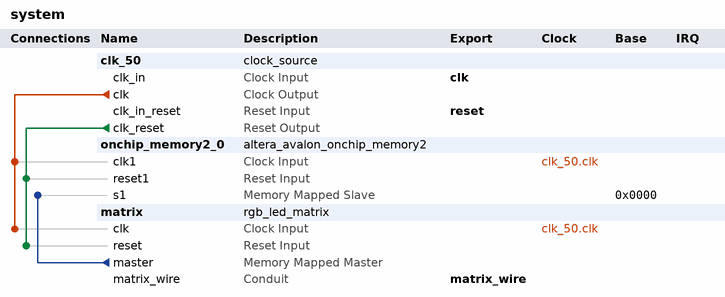
[diagram p0: system contents]
# Platform Designer (Qsys) system system, Cyclone IV E EP4CE22F17C6
# Parameters at their usual value, and those the tool derives, are not listed.
package require -exact qsys 17.1
create_system system
set_project_property DEVICE_FAMILY {Cyclone IV E}
set_project_property DEVICE EP4CE22F17C6

add_instance clk_50 clock_source 17.1
set_instance_parameter_value clk_50 clockFrequency 50000000

add_instance onchip_memory2_0 altera_avalon_onchip_memory2 17.1
set_instance_parameter_value onchip_memory2_0 dataWidth 64
set_instance_parameter_value onchip_memory2_0 dualPort false
set_instance_parameter_value onchip_memory2_0 initMemContent true
set_instance_parameter_value onchip_memory2_0 initializationFileName mif/test.mif
set_instance_parameter_value onchip_memory2_0 memorySize 16384
set_instance_parameter_value onchip_memory2_0 useNonDefaultInitFile true

add_instance matrix rgb_led_matrix 1.0
set_instance_parameter_value matrix INPUT_CLK_FRQ 50000000
set_instance_parameter_value matrix MATRIX_HEIGHT 32
set_instance_parameter_value matrix MATRIX_WIDTH 64
set_instance_parameter_value matrix NUM_OF_MATRICES 2
set_instance_parameter_value matrix RAM_ADDRESS_WIDTH 14

# connections
add_connection clk_50.clk matrix.clk clock
add_connection clk_50.clk onchip_memory2_0.clk1 clock
add_connection clk_50.clk_reset matrix.reset reset
add_connection clk_50.clk_reset onchip_memory2_0.reset1 reset
add_connection matrix.master onchip_memory2_0.s1 avalon
set_connection_parameter_value matrix.master/onchip_memory2_0.s1 baseAddress 0x0000

# exported interfaces
add_interface clk clock sink
set_interface_property clk EXPORT_OF clk_50.clk_in
add_interface matrix_wire conduit end
set_interface_property matrix_wire EXPORT_OF matrix.matrix_wire
add_interface reset reset sink
set_interface_property reset EXPORT_OF clk_50.clk_in_reset

set_interconnect_requirement {$system} qsys_mm.clockCrossingAdapter HANDSHAKE
set_interconnect_requirement {$system} qsys_mm.enableEccProtection FALSE
set_interconnect_requirement {$system} qsys_mm.insertDefaultSlave FALSE
set_interconnect_requirement {$system} qsys_mm.maxAdditionalLatency 1

save_system system.qsys
